# EAGLE design master_schematic (EAGLE 9.3.0)
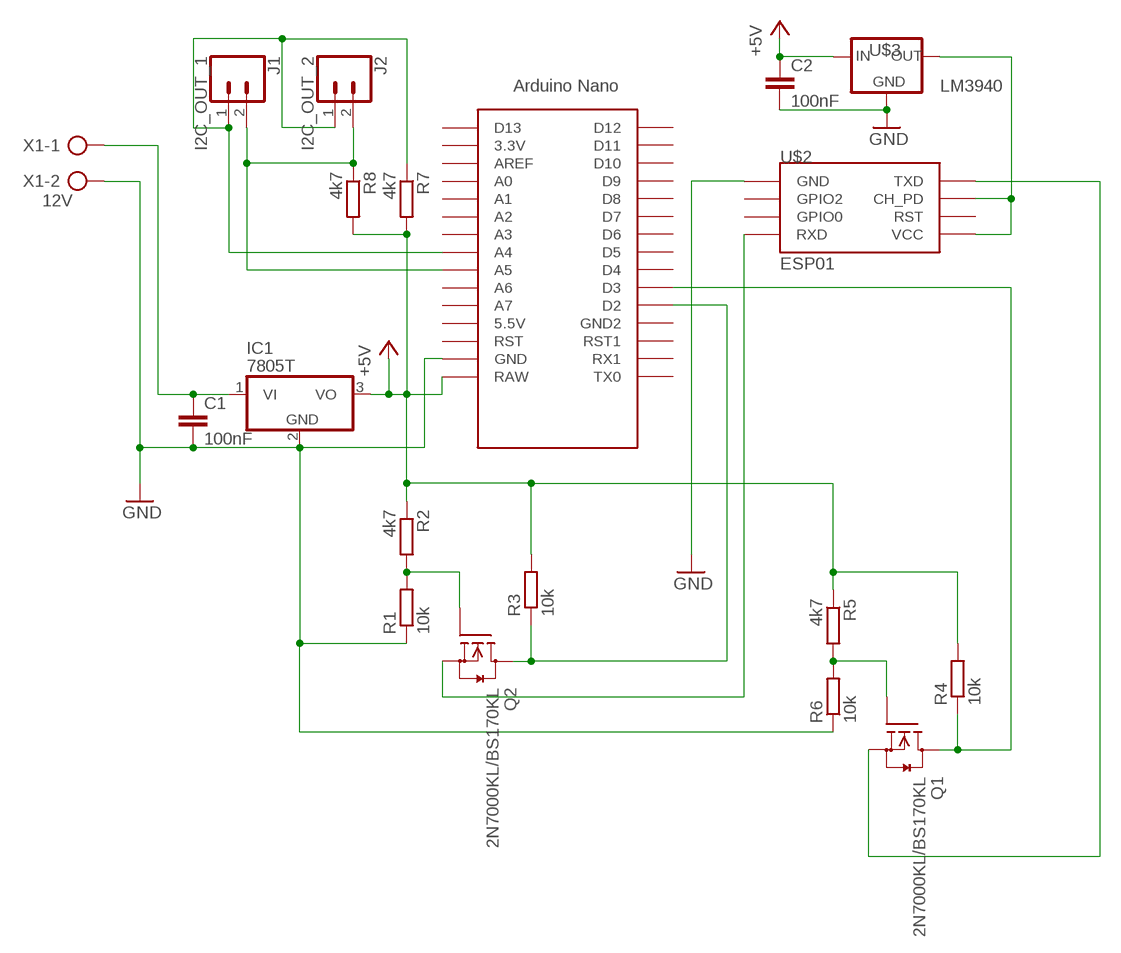
[diagram p0: schematic, sheet 1]

## Parts
C1  100nF  C-EU025-030X050  [C025-030X050]
C2  100nF  C-EU025-030X050  [C025-030X050]
IC1  7805T  [TO220H]
J1  I2C_OUT_1  CONN_02JST-PTH-2  [JST-2-PTH]
J2  I2C_OUT_2  CONN_02JST-PTH-2  [JST-2-PTH]
Q1  2N7000KL/BS170KL  [TO92]
Q2  2N7000KL/BS170KL  [TO92]
R1  10k  R-EU_0207/10  [0207/10]
R2  4k7  R-EU_0207/10  [0207/10]
R3  10k  R-EU_0207/10  [0207/10]
R4  10k  R-EU_0207/10  [0207/10]
R5  4k7  R-EU_0207/10  [0207/10]
R6  10k  R-EU_0207/10  [0207/10]
R7  4k7  R-EU_0207/10  [0207/10]
R8  4k7  R-EU_0207/10  [0207/10]
U$1  NANO  [NANO]
U$2  ESP01  [ESP01]
U$3  LM3940  [TO220]
X1  12V  AK300/2  [AK300/2]

## Nets
+5V: C2.1 IC1.3(VO) R2.1 R3.2 R4.2 R5.1 R7.2 R8.2 U$1.RAW U$3.1(IN)
GND: C1.2 C2.2 IC1.2(GND) R1.1 R6.1 U$1.GND U$2.GND U$3.2(GND) X1.2
N$1: J1.1 J2.1 R7.1 U$1.A4
N$2: J1.2 J2.2 R8.1 U$1.A5
N$4: C1.1 IC1.1(VI) X1.1
N$5: Q2.1(S) U$2.RX(RXD)
N$7: Q2.2(G) R1.2 R2.2
N$9: U$2.CH_PD U$2.VCC U$3.3(OUT)
N$11: Q1.2(G) R5.2 R6.2
N$12: Q1.3(D) R4.1 U$1.D3
N$13: Q2.3(D) R3.1 U$1.D2
N$14: Q1.1(S) U$2.TX(TXD)
Unconnected: U$1.3.3V U$1.5V(5.5V) U$1.A0 U$1.A1 U$1.A2 U$1.A3 U$1.A6 U$1.A7 U$1.AREF U$1.D4 U$1.D5 U$1.D6 U$1.D7 U$1.D8 U$1.D9 U$1.D10 U$1.D11 U$1.D12 U$1.D13 U$1.GND1(GND2) U$1.ICSP1 U$1.ICSP2 U$1.ICSP3 U$1.ICSP4 U$1.ICSP5 U$1.ICSP6 U$1.RST U$1.RST1 U$1.RX1 U$1.TX0 U$2.GPIO0 U$2.GPIO2 U$2.RST

## Library data of the parts
C1 C2 = rcl:C-EU: CAPACITOR, European symbol; SPICEPREFIX: C
IC1 = linear:78*: Positive VOLTAGE REGULATOR Source: http://cache.national.com/ds/LM/LM78L05.pdf http://www.fairchildsemi.com/ds/LM/LM7805.pdf
J1 J2 = SparkFun-Connectors:CONN_02: Multi connection point. Often used as Generic Header-pin footprint for 0.1 inch spaced/style header connections On any of the 0.1 inch spaced packages, you can populate with these: Break Away Headers - Straight <https://www.sparkfun.com/products/116> (PRT-00116) Break Away Male Headers - Right Angle <https://www.sparkfun.com/products/553> (PRT-00553) Female Headers <https://www.sparkfun.com/products/115> (PRT-00115) Break Away Headers - Machine Pin <https://www.sparkfun.com/products/117> (PRT-00117) Break Away Female Headers - Swiss Machine Pin <https://www.sparkfun.com/products/743> (PRT-00743) For SCREWTERMINALS and SPRING TERMINALS visit here: Screw Terimnals on SparkFun.com <https://www.sparkfun.com/search/results?term=Screw+Terminals> (5mm/3.5mm/2.54mm spacing) This device is also useful as a general connection point to wire up your design to another part of your project. Our various solder wires solder well into these plated through hole pads. Hook-Up Wire - Assortment (Stranded, 22 AWG) <https://www.sparkfun.com/products/11375> (PRT-11375) Hook-Up Wire - Assortment (Solid Core, 22 AWG) <https://www.sparkfun.com/products/11367> (PRT-11367) View the entire wire category on our website here <https://www.sparkfun.com/categories/141> Special notes: Molex polarized connector foot print use with: PRT-08233 with associated crimp pins and housings. 2.54_SCREWTERM for use with PRT-10571. 3.5mm Screw Terminal footprints for PRT-08084 5mm Screw Terminal footprints for use with PRT-08432; PROD_ID: CONN-09863; SKU: PRT-09914
Q1 Q2 = m-pad-2.1:2N7000KL/BS170KL: Vishay Siliconix 2N7000KL/BS170KL N-Channel 60-V (D-S) MOSFET FEATURES: TrenchFET Power MOSFET ESD Protected: 2000 V APPLICATIONS: Direct Logic-Level Interface: TTL/CMOS Soild State Relays Drivers: Relays, Solenoids, Lamps, Hammers, Displays, Memories, Transistors, etc. Battery Operated Systems Please send any comments to: messi@users.sourceforge.net
R1-R8 = rcl:R-EU_: RESISTOR, European symbol; SPICEPREFIX: R
U$1 = Arduino-clone:NANO: Arduino Nano
U$2 = esp8266modules:ESP01: ESP8266 Wifi module 01
U$3 = LM3940:LM3940: LM3940 1A Low Dropout Regulator for 5V to 3.3V Conversion; AVAILABILITY: Unavailable; MF: National Semiconductor; MP: LM3940; PACKAGE: None; PRICE: None
X1 = con-ptr500:AK300/2: CONNECTOR; OC_FARNELL: unknown; OC_NEWARK: unknown

## Board
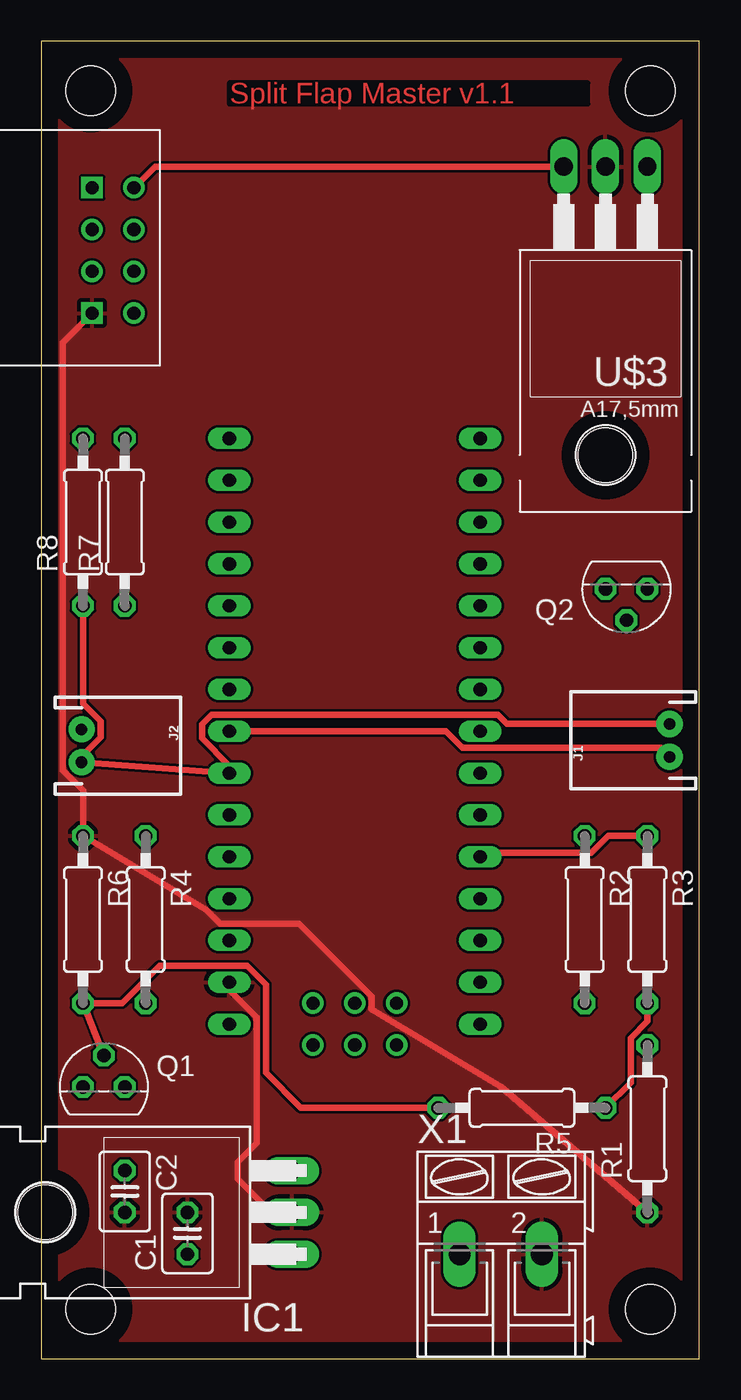
[diagram p1: board, top side]
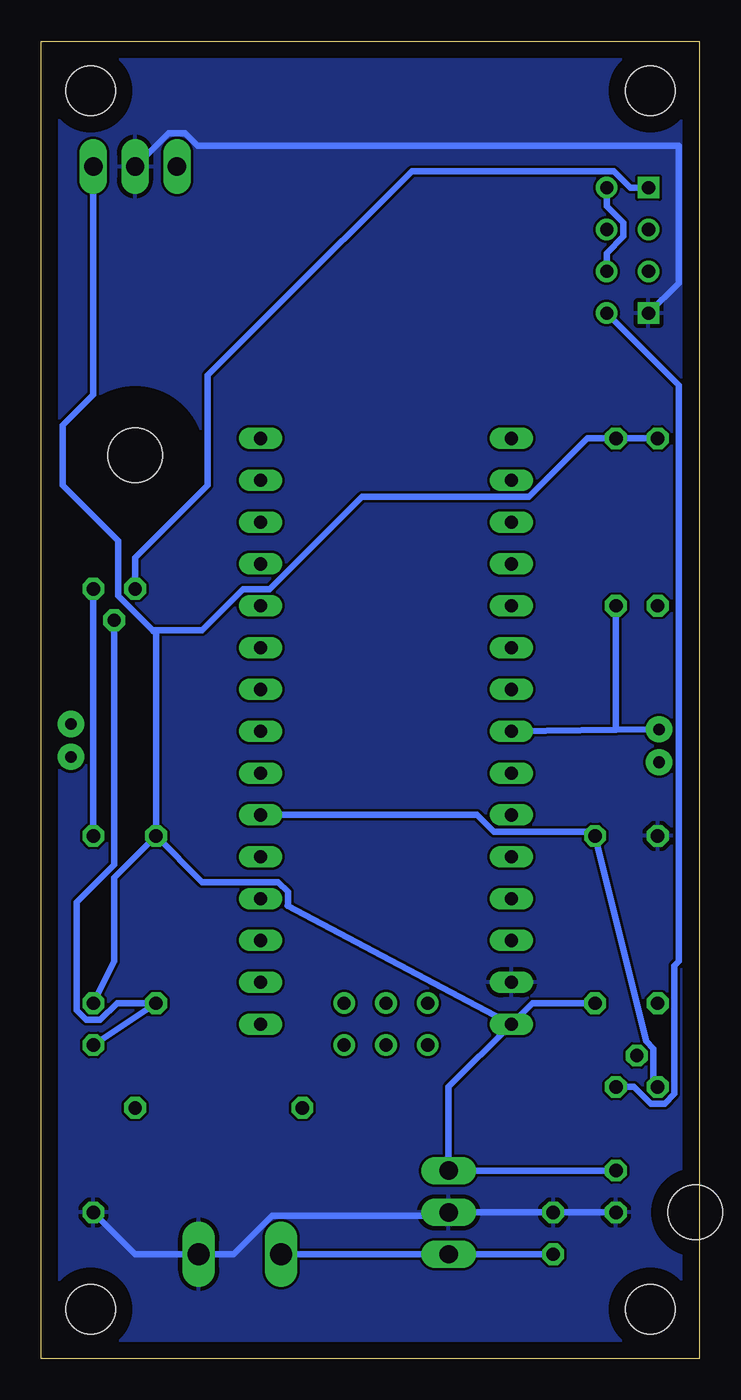
[diagram p2: board, bottom side, seen from below]

Size 40 x 80 mm. Coordinates in mm from the lower left corner, seen from the top.
Outline: 0,0 40,0 40,80 0,80 0,0
Copper layers (1*16): Top 0.035mm / dielectric 1.5mm / Bottom 0.035mm
Design rules "default": minimum track width 6mil, minimum drill 0.35mm, track to track 6mil, track to pad 6mil, pad to pad 6mil, via to via 6mil, smd to smd 6mil, copper to edge 40mil, drill to drill 6mil, minimum pad ring 10mil, minimum via ring 8mil, stop-mask expansion 4mil, vias tented up to drill 0mil, thermal gap 10mil
Holes 3 mm at 3,77 37,77 37,3 3,3

### Footprints (pad centres in the part's own frame; a part is rotated, then mirrored left to right if it is on the bottom)
C025-030X050 = drill 0.813 octagon: 1 -1.27,0; 2 1.27,0
TO220H = drill 1.118 long: 1 -2.54,-10.16; 2 0,-10.16; 3 2.54,-10.16 | hole 3.302: 0,4.826
JST-2-PTH = drill 0.7 pad 1.6: 1 -1,0; 2 1,0
TO92 = drill 0.813 octagon: 1 1.27,0; 2 0,1.905; 3 -1.27,0
0207/10 = drill 0.813 octagon: 1 -5.08,0; 2 5.08,0
NANO = drill 0.8 long: 3.3V -10.16,24.13; 5V -10.16,-1.27; A0 -10.16,19.05; A1 -10.16,16.51; A2 -10.16,13.97; A3 -10.16,11.43; A4 -10.16,8.89; A5 -10.16,6.35; A6 -10.16,3.81; A7 -10.16,1.27; AREF -10.16,21.59; D2 5.08,1.27; D3 5.08,3.81; D4 5.08,6.35; D5 5.08,8.89; D6 5.08,11.43; D7 5.08,13.97; D8 5.08,16.51; D9 5.08,19.05; D10 5.08,21.59; D11 5.08,24.13; D12 5.08,26.67; D13 -10.16,26.67; GND -10.16,-6.35; GND1 5.08,-1.27; RAW -10.16,-8.89; RST -10.16,-3.81; RST1 5.08,-3.81; RX1 5.08,-6.35; TX0 5.08,-8.89 | drill 0.8: ICSP1 -5.08,-10.16; ICSP2 -5.08,-7.62; ICSP3 -2.54,-10.16; ICSP4 -2.54,-7.62; ICSP5 0,-10.16; ICSP6 0,-7.62
ESP01 = drill 0.8: CH_PD -1.285,-8.178; GPIO0 1.255,-5.638; GPIO2 -1.285,-5.638; RST 1.255,-8.178; TX -3.825,-8.178; VCC 3.795,-8.178 | drill 0.8 square: GND -3.825,-5.638; RX 3.795,-5.638
TO220 = drill 1.118 long: 1 -2.54,-10.16; 2 0,-10.16; 3 2.54,-10.16 | hole 3.302: 0,7.366
AK300/2 = drill 1.321 long: 1 -2.515,0; 2 2.489,0

### Placement (x,y rotation side)
C1  8.89,7.62 90 top
C2  5.08,10.16 270 top
IC1  5.08,8.89 90 top
J1  38.18,37.55 90 top
J2  2.46,37.22 270 top
Q1  3.81,16.51 0 top
Q2  35.56,46.75 180 top
R1  36.83,13.97 90 top
R2  33.02,26.67 270 top
R3  36.83,26.67 270 top
R4  6.35,26.67 270 top
R5  29.21,15.24 180 top
R6  2.54,26.67 270 top
R7  5.08,50.8 90 top
R8  2.54,50.8 90 top
U$1  21.59,29.21 0 top
U$2  -2.54,67.31 90 top
U$3  34.29,62.23 180 top
X1  27.94,6.35 0 top

### Tracks (layer width: path | path; a pad name or v marks a point on that pad's centre or on a via)
+5V
  Top 0.406: R5.1 35.81,16.76 35.81,19.47 36.83,20.49 R3.2
  Bottom 0.406: U$1.RAW 10.16,21.59 R4.2 | U$1.RAW 25.02,27.51 25.01,27.52 25.01,28.36 25.6,28.95 30.22,28.95 R2.1 | R3.2 35.56,24.13 35.56,29.21 R2.1 | U$1.RAW 15.24,16.51 IC1.3 C2.1 | R2.1 33.02,44.04 33.22,44.25 | 33.22,44.25 35.31,46.33 35.31,49.67 38.68,53.04 38.68,56.68 36.83,58.54 U$3.1 | R8.2 R7.2 6.81,55.88 10.36,52.33 20.52,52.33 26.12,46.73 27.74,46.73 30.23,44.25 33.22,44.25
GND
  Top 0.406: R1.1 27.94,16.51 20.06,21.24 20.06,22.01 15.66,26.41 10.88,26.41 10.04,27.25 R6.1 2.54,34.51 1.3,35.74 1.3,61.69 U$2.GND | U$1.GND 11.43,22.4 13.09,20.74 13.09,13.08 11.94,11.92 11.94,10.94 13.98,8.89 IC1.2
  Bottom 0.406: R1.1 34.29,6.35 X1.2 28.32,6.35 25.98,8.69 15.44,8.69 IC1.2 C1.2 C2.2 | U$2.GND 1.27,65.31 1.27,73.66 30.49,73.66 31.26,74.42 32.26,74.42 U$3.2
  pour Bottom: 0,80 0,0 40,0 40,80
  pour Top: 0,80 0,0 40,0 40,80
N$1
  Top 0.406: U$1.A4 24.59,38.1 25.6,37.09 37.64,37.09 J1.1
  Bottom 0.406: U$1.A4 5.08,38.19 | 5.08,38.19 J2.1 | R7.1 5.08,38.19
N$2
  Top 0.406: J1.2 28.3,38.55 27.74,39.11 10.36,39.11 9.77,38.52 9.77,37.68 11.43,36.02 U$1.A5 J2.2 2.46,36.59 3.62,37.74 3.62,38.7 2.54,39.77 R8.1
N$4
  Bottom 0.406: X1.1 IC1.1 C1.1
N$5
  Bottom 0.406: Q2.1 34.29,48.65 29.9,53.04 29.9,59.7 26.39,63.22 25.86,63.74 17.49,72.11 5.22,72.11 4.21,71.11 U$2.RX
N$7
  Bottom 0.406: R1.2 R2.2 35.39,21.59 36.41,20.57 37.25,20.57 37.85,21.17 37.85,27.71 35.56,30 Q2.2
N$9
  Top 0.406: U$2.VCC 6.92,72.39 U$3.3
  Bottom 0.406: U$2.CH_PD 5.64,67.14 4.63,68.15 4.63,68.98 5.64,69.99 U$2.VCC
N$11
  Top 0.406: Q1.2 R6.2 4.91,21.59 7.19,23.87 10.36,23.87 11.43,23.87 12.5,23.87 13.65,22.72 13.65,17.36 15.77,15.24 R5.2
N$12
  Bottom 0.406: Q1.3 2.79,16.76 2.79,18.84 3.23,19.27 R4.1 6.61,32.01 12.5,32.01 13.51,33.02 U$1.D3
N$13
  Top 0.406: U$1.D2 26.92,30.73 33.44,30.73 34.46,31.75 R3.1
  Bottom 0.406: R3.1 Q2.3
N$14
  Bottom 0.406: Q1.1 3.98,16.51 2.96,15.49 2.12,15.49 1.52,16.09 1.52,23.88 1.27,24.13 1.27,59.12 U$2.TX

### Text on the board
Top: Split Flap Master v1.1